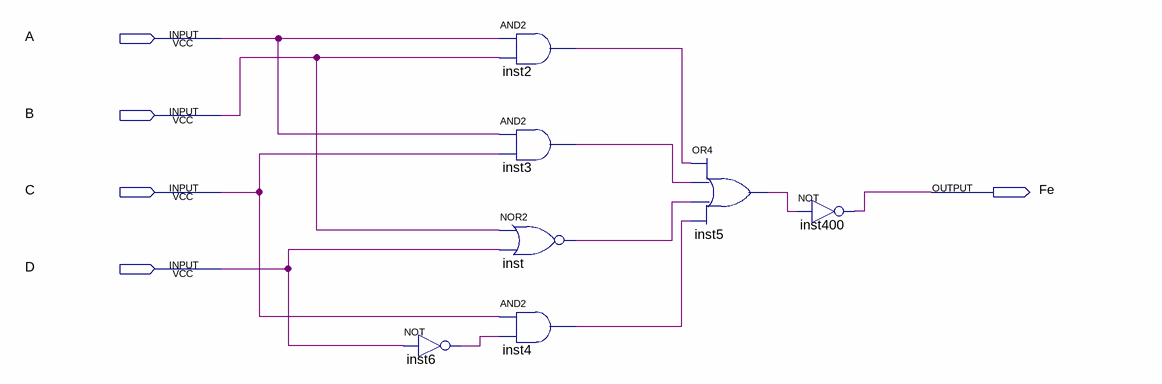
[diagram p0: schematic sheet]
// Quartus schematic fe.bdf as structural Verilog: 7 symbols, 5 pins
module fe (
  input  A,
  input  B,
  input  C,
  input  D,
  output Fe
);

  wire inst2_out, inst3_out, inst4_out, inst5_out, inst6_out, inst_out;

  not inst6 (inst6_out, D);
  and inst2 (inst2_out, A, B);
  and inst3 (inst3_out, A, C);
  nor inst (inst_out, B, D);
  and inst4 (inst4_out, C, inst6_out);
  or inst5 (inst5_out, inst2_out, inst3_out, inst_out, inst4_out);
  not inst400 (Fe, inst5_out);
endmodule
